# Altium schematic sheet RS485.SchDoc
size A4; Organization: Miltera; Address1: Bilişim Vadisi Muallim Mah.; Address2: Deniz Cad.; Address3: No:143/5 A7 Blok; Address4: Kat:2 Kapı No:35; SheetNumber: 4; SheetTotal: 7
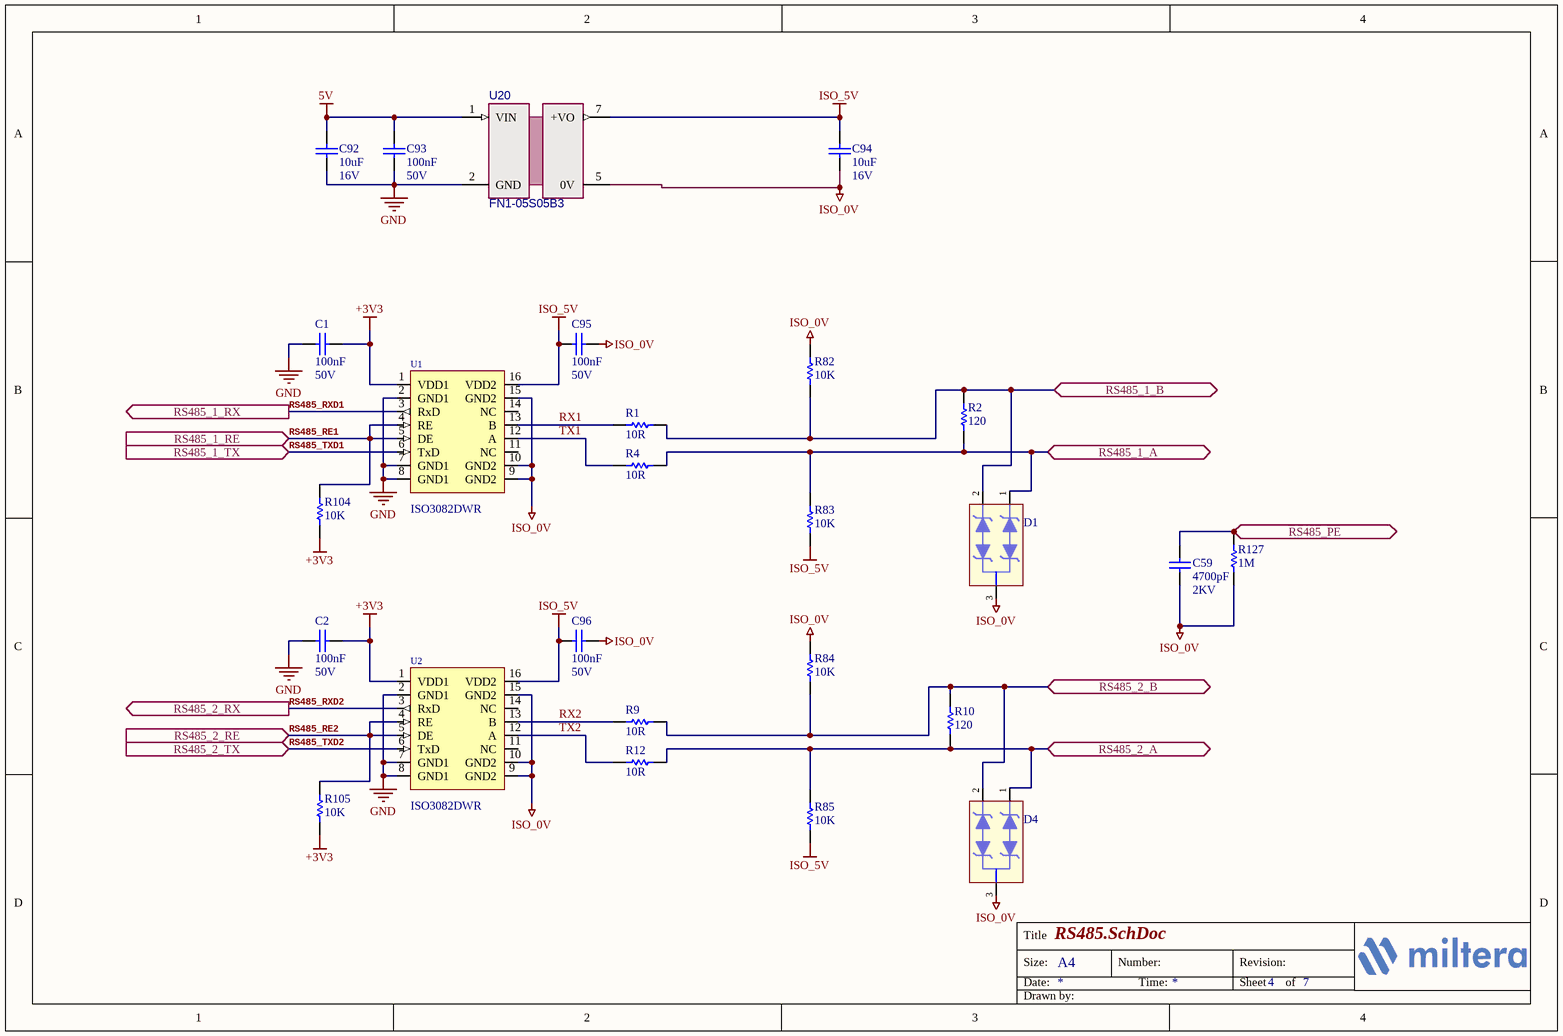
[diagram p0: RS485.SchDoc]

## Parts
C1  value 100nF  Voltage: 50V  [CAP_0603]  (hidden comment: CAP)
C2  value 100nF  Voltage: 50V  [CAP_0603]  (hidden comment: CAP)
C59  value 4700pF  Voltage: 2KV  [CAPC4632X300N]  (hidden comment: 202S43W472KV4E)
C92  value 10uF  Voltage: 16V  [CAP_0805]  (hidden comment: CAP)
C93  value 100nF  Voltage: 50V  [CAP_0603]  (hidden comment: CAP)
C94  value 10uF  Voltage: 16V  [CAP_0805]  (hidden comment: CAP)
C95  value 100nF  Voltage: 50V  [CAP_0603]  (hidden comment: CAP)
C96  value 100nF  Voltage: 50V  [CAP_0603]  (hidden comment: CAP)
D1  TVS-RS485  [SOT-23]  (value not drawn)
D4  TVS-RS485  [SOT-23]  (value not drawn)
R1  value 10R  [RES_0603]  (hidden comment: RES)
R2  value 120  [RES_0603]  (hidden comment: RES)
R4  value 10R  [RES_0603]  (hidden comment: RES)
R9  value 10R  [RES_0603]  (hidden comment: RES)
R10  value 120  [RES_0603]  (hidden comment: RES)
R12  value 10R  [RES_0603]  (hidden comment: RES)
R82  value 10K  [RES_0603]  (hidden comment: RES)
R83  value 10K  [RES_0603]  (hidden comment: RES)
R84  value 10K  [RES_0603]  (hidden comment: RES)
R85  value 10K  [RES_0603]  (hidden comment: RES)
R104  value 10K  [RES_0603]  (hidden comment: RES)
R105  value 10K  [RES_0603]  (hidden comment: RES)
R127  value 1M  [RES_1206]  (hidden comment: CRMA1206AF1M00FKEF)
U1  ISO3082DWR  [16-SOIC]
U2  ISO3082DWR  [16-SOIC]
U20  FN1-05S05B3  [F0505S1WR3]

## Ports
RS485_1_A (bidir), RS485_1_B (bidir), RS485_1_RE (in), RS485_1_RX (out), RS485_1_TX (in), RS485_2_A (bidir), RS485_2_B (bidir), RS485_2_RE (in), RS485_2_RX (out), RS485_2_TX (in), RS485_PE (bidir)

## Nets
5V: C92.1 C93.1 U20.1(VIN)
+3V3: C1.2 C2.2 R104.2 R105.2 U1.1(VDD1) U2.1(VDD1)
GND: C1.1 C2.1 C92.2 C93.2 U1.2(GND1) U1.7(GND1) U1.8(GND1) U2.2(GND1) U2.7(GND1) U2.8(GND1) U20.2(GND)
ISO_0V: C59.1 C94.2 C95.2 C96.2 D1.3 D4.3 R82.1 R84.1 R127.2 U1.9(GND2) U1.10(GND2) U1.15(GND2) U2.9(GND2) U2.10(GND2) U2.15(GND2) U20.5(0V)
ISO_5V: C94.1 C95.1 C96.1 R83.2 R85.2 U1.16(VDD2) U2.16(VDD2) U20.7(+VO)
RS485_1_A: D1.1 R2.2 R4.2 R83.1 ; port RS485_1_A
RS485_1_B: D1.2 R1.2 R2.1 R82.2 ; port RS485_1_B
RS485_2_A: D4.1 R10.2 R12.2 R85.1 ; port RS485_2_A
RS485_2_B: D4.2 R9.2 R10.1 R84.2 ; port RS485_2_B
RS485_PE: C59.2 R127.1 ; port RS485_PE
RS485_RE1: R104.1 U1.4(RE) U1.5(DE) ; port RS485_1_RE
RS485_RE2: R105.1 U2.4(RE) U2.5(DE) ; port RS485_2_RE
RS485_RXD1: U1.3(RxD) ; port RS485_1_RX
RS485_RXD2: U2.3(RxD) ; port RS485_2_RX
RS485_TXD1: U1.6(TxD) ; port RS485_1_TX
RS485_TXD2: U2.6(TxD) ; port RS485_2_TX
RX1: R1.1 U1.13(B)
RX2: R9.1 U2.13(B)
TX1: R4.1 U1.12(A)
TX2: R12.1 U2.12(A)

Not connected (* = marked no-connect by the designer): U1 11(NC) 14(NC); U2 11(NC) 14(NC)

## Notes on the sheet
- Title
- Size:
- Date:
- A4
- Number:
- Time:
- Revision:
- Sheet
- of
- Drawn by:

## Library data of the parts
C1 C2 C93 C95 C96 = C01763: CAP CER 100nF 50VDC %10 X7R SMD; Manufacturer: Samsung; Manufacturer Part Number: CL10B104KB8NNNL
C59 = C01763: CAP CER 4.7nF 2kV X7R 1812; Manufacturer: Johanson Dielectrics; Manufacturer Part Number: 202S43W472KV4E
C92 C94 = C01758: CAP CER 10UF 16VDC %10 X5R SMD; Manufacturer: Samsung; Manufacturer Part Number: CL21A106KOQNNNE
D1 D4 = DIO00011: TVS DIODE 7V/12V 14V/26V SOT23-3; Manufacturer Part Number: SM712-02HTG; Manufacturer: LittelFuse Inc.
R1 R4 R9 R12 = R03008: RES 0603 10 Ohms 1% 1/10W-S 100PPM; Manufacturer: ROYALOHM; Manufacturer Part Number: 0603SAF100JT5E
R2 R10 = R01006: RES SMD 120 OHM 1% 1/10W 0603; Manufacturer: Yageo; Manufacturer Part Number: RC0603FR-07120RL
R82-R85 R104 R105 = R02995: RES 0603 10k Ohms %1 1/10W 100PPM; Manufacturer: ROYALOHM; Manufacturer Part Number: 0603SAF1002T5E
R127 = R02995: RES 1MΩ ±1% 300mW 1206; Manufacturer: VISHAY; Manufacturer Part Number: CRMA1206AF1M00FKEF
U1 U2 = P000130: RS422, RS485 Digital Isolator 2500Vrms Channel 200kbps 25kV/µs CMTI 16-SOIC (0.295", 7.50mm Width); Manufacturer: Texas Ins.; Manufacturer Part Number: ISO3082DWR
U20 = F0505S-1WR3_FN1-05S05B3: Isolated Module DC DC Converter 1 Output 5V 200mA 4.5V - 5.5V Input; Manufacturer: AIPU; Package: 8-SMD; Manufacturer Part Number: FN1-05S05B3; Value: FN1-05S05B3